# Altium schematic sheet micro.SchDoc
size 431 x 279 mm; SheetNumber: 2; SheetTotal: 2
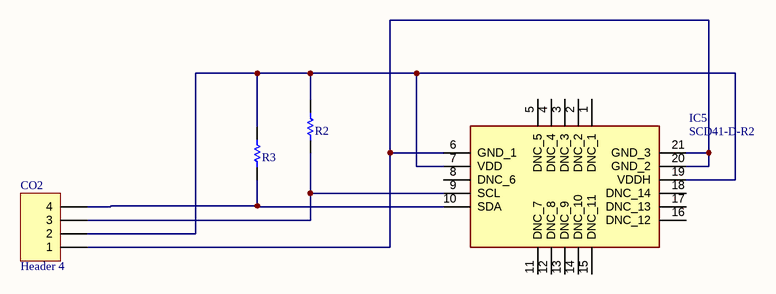
[diagram p0: micro.SchDoc]

## Parts
CO2  Header 4  [HDR1X4]
IC5  SCD41-D-R2  [SCD41DR2]
R2  ERA3AEB1131V  [RESC1608X55X30ML20T20]  (value not drawn)
R3  ERA3AEB1131V  [RESC1608X55X30ML20T20]  (value not drawn)

## Nets
NetCO2_1: CO2.1 IC5.6(GND_1) IC5.20(GND_2) IC5.21(GND_3)
NetCO2_2: CO2.2 IC5.7(VDD) IC5.19(VDDH) R2.1 R3.1
NetCO2_3: CO2.3 IC5.9(SCL) R2.2
NetCO2_4: CO2.4 IC5.10(SDA) R3.2

Not connected (* = marked no-connect by the designer): IC5 1(DNC_1) 2(DNC_2) 3(DNC_3) 4(DNC_4) 5(DNC_5) 8(DNC_6) 11(DNC_7) 12(DNC_8) 13(DNC_9) 14(DNC_10) 15(DNC_11) 16(DNC_12) 17(DNC_13) 18(DNC_14)

## Notes on the sheet
- DWG. NO.
- REV.
- SHT.
- THIS DOCUMENT AND THE DATA DISCLOSED HEREIN OR HEREWITH IS THE PROPERTY OF ALTIUM LIMITED AND MAY BE FREELY DISTRIBUTED IN WHOLE. NO RIGHTS ARE RESERVED OR EXPRESS OR IMPLIED WARANTEE GIVEN.
- REVISION
- DESCRIPTION
- DATE
- APPROVED
- ENG:
- APPROVALS
- PROJECT
- DSN:
- CHK:
- REFERENCE DOCUMENTS
- PROJECT REVISION:
- TITLE
- DOCUMENT REVISION:
- DESIGN ITEM:
- BOM:
- FAB DWG:
- PCB DWG:
- ASSY DWG:
- SCALE:
- SIZE
- B
- CAGE CODE
- FILE NAME
- DWG NO.
- SHEET
- OF
- REV

## Library data of the parts
CO2 = Header 4: Header, 4-Pin; LatestRevisionDate: 17-Jul-2002; LatestRevisionNote: Re-released for DXP Platform.; Publisher: Altium Limited
IC5 = SCD41-D-R2: Integrated Circuit; Manufacturer_Name: Sensirion; Datasheet Link: https://cz.mouser.com/datasheet/2/682/Sensirion_CO2_Sensors_SCD4x_Datasheet-2010009.pdf; Height: 6.8mm; Manufacturer_Part_Number: SCD41-D-R2; Mouser Part Number: 403-SCD41-D-R2; Mouser Price/Stock: https://www.mouser.co.uk/ProductDetail/Sensirion/SCD41-D-R2?qs=HBWAp0VN4Ri4o7ei4T3s0g%3D%3D; Arrow Part Number: SCD41-D-R2; Arrow Price/Stock: https://www.arrow.com/en/products/scd41-d-r2/sensirion-ag?region=nac
R2 R3 = CMP-2000-00883-1: Manufacturer: Panasonic; Part Number: ERA3AEB1131V